# Altium project khoa so dien tu.PrjPcb
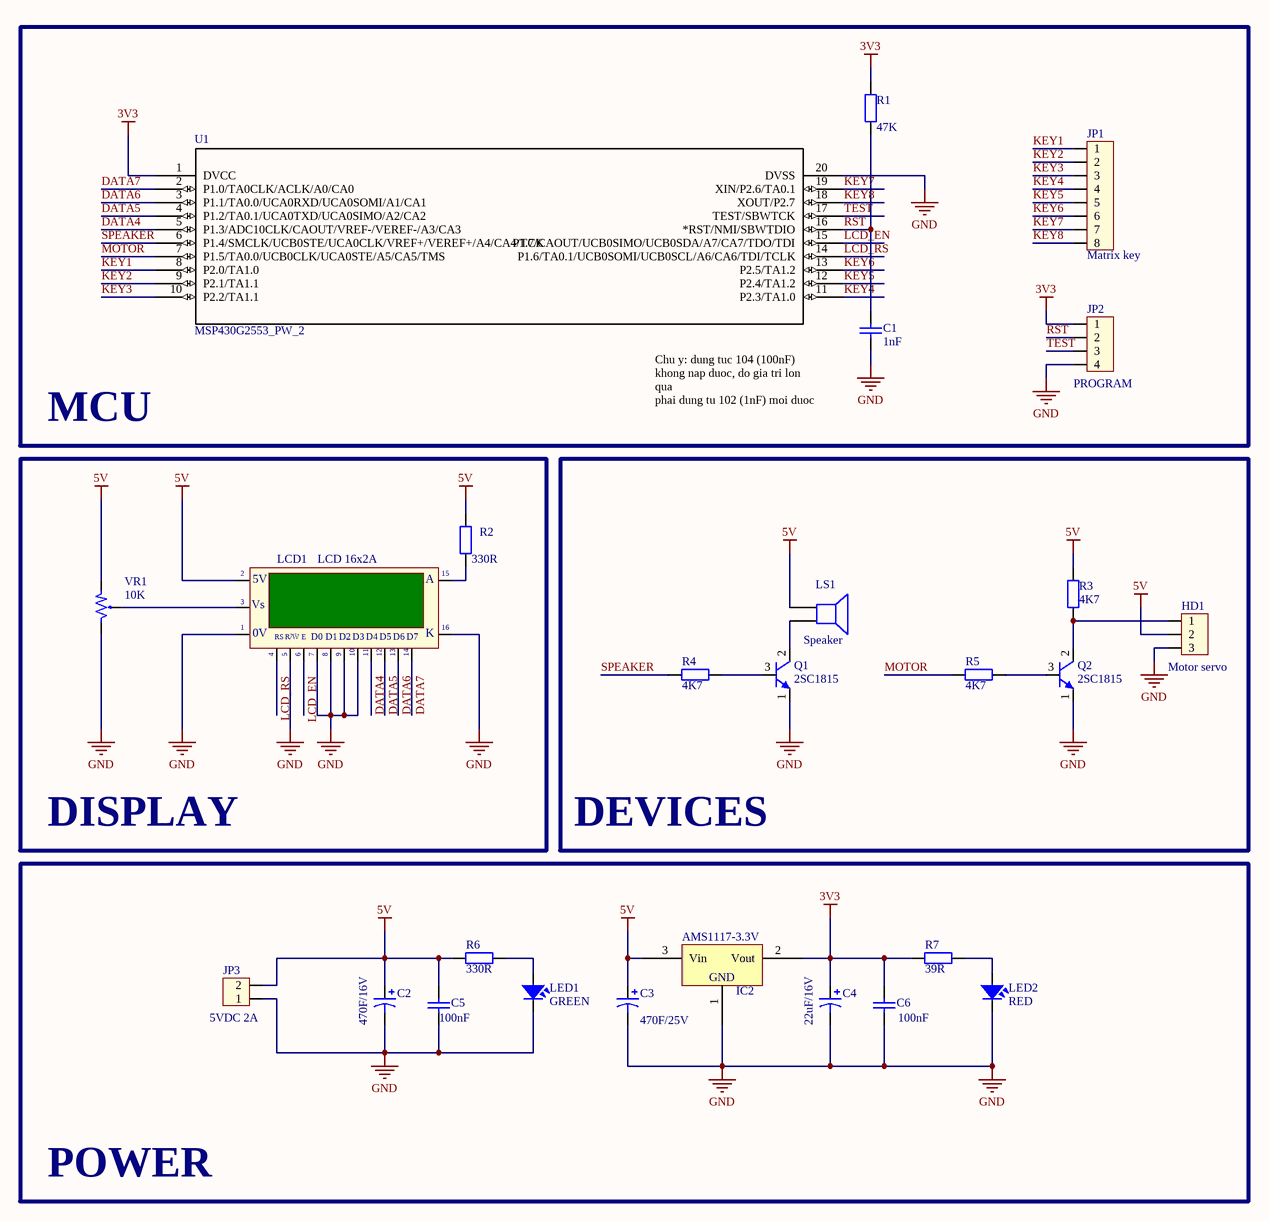
[diagram p0: khoa so dien tu.SchDoc]
1 sheet, 26 parts. Net scope: global (net labels, ports and power ports of the same name join across sheets).

## Sheet khoa so dien tu.SchDoc: KHOA SO DIEN TU
size A3; Organization: DH Bach Khoa Da Nang; SheetNumber: 01; SheetTotal: 01; ProjectName: Khoa so dien tu

### Parts
C1  value 1nF  [Tu gom 104]  (hidden comment: Cap)
C2  value 470F/16V  [CAP_470UF_16V]  (hidden comment: Cap Pol1)
C3  value 470F/25V  [CAP_470UF_25V]  (hidden comment: Cap Pol1)
C4  value 22uF/16V  [CAP_22UF_16V]  (hidden comment: Cap Pol1)
C5  value 100nF  [Tu gom 104]  (hidden comment: Cap)
C6  value 100nF  [Tu gom 104]  (hidden comment: Cap)
HD1  Motor servo  [Header_3]
IC2  AMS1117-3.3V  [AMS1117-3.3V]
JP1  Matrix key  [Header_8]
JP2  PROGRAM  [Header_4]
JP3  5VDC 2A  [CON2]
LCD1  LCD 16x2A  [LCD16x2]
LED1  GREEN  [LED3G]
LED2  RED  [LED3R]
LS1  Speaker  [SPEAKER]
Q1  2SC1815  [2SC1815]
Q2  2SC1815  [2SC1815]
R1  value 47K  [RES 1/4W CFR25]  (hidden comment: Res2)
R2  value 330R  [RES 1/4W CFR25]  (hidden comment: Res2)
R3  value 4K7  [RES 1/4W CFR25]  (hidden comment: Res2)
R4  value 4K7  [RES 1/4W CFR25]  (hidden comment: Res2)
R5  value 4K7  [RES 1/4W CFR25]  (hidden comment: Res2)
R6  value 330R  [RES 1/4W CFR25]  (hidden comment: Res2)
R7  value 39R  [RES 1/4W CFR25]  (hidden comment: Res2)
U1  MSP430G2553_PW_2  [MSP430G2553]
VR1  10K  [VR1]

### Blocks framed on the sheet
MCU: C1 JP1 JP2 R1 U1
DISPLAY: LCD1 R2 VR1
DEVICES: HD1 LS1 Q1 Q2 R3-R5
POWER: C2-C6 IC2 JP3 LED1 LED2 R6 R7

### Nets
3V3: C4.1 C6.2 IC2.2(Vout) JP2.1 R1.2 R7.2 U1.1(DVCC)
5V: C2.1 C3.1 C5.2 HD1.2 IC2.3(Vin) JP3.2 LCD1.2(VDD) LS1.2 R2.2 R3.2 R6.2 VR1.1
GND: C1.2 C2.2 C3.2 C4.2 C5.1 C6.1 HD1.3 IC2.1(GND) JP2.4 JP3.1 LCD1.1(GND) LCD1.5(R/~{W}) LCD1.7(D0) LCD1.8(D1) LCD1.9(D2) LCD1.10(D3) LCD1.16(K) LED1.2 LED2.2 Q1.1(E) Q2.1(E) U1.20(DVSS) VR1.3
DATA4: LCD1.11(D4) U1.5(P1.3/ADC10CLK/CAOUT/VREF-/VEREF-/A3/CA3)
DATA5: LCD1.12(D5) U1.4(P1.2/TA0.1/UCA0TXD/UCA0SIMO/A2/CA2)
DATA6: LCD1.13(D6) U1.3(P1.1/TA0.0/UCA0RXD/UCA0SOMI/A1/CA1)
DATA7: LCD1.14(D7) U1.2(P1.0/TA0CLK/ACLK/A0/CA0)
KEY1: JP1.1 U1.8(P2.0/TA1.0)
KEY2: JP1.2 U1.9(P2.1/TA1.1)
KEY3: JP1.3 U1.10(P2.2/TA1.1)
KEY4: JP1.4 U1.11(P2.3/TA1.0)
KEY5: JP1.5 U1.12(P2.4/TA1.2)
KEY6: JP1.6 U1.13(P2.5/TA1.2)
KEY7: JP1.7 U1.19(XIN/P2.6/TA0.1)
KEY8: JP1.8 U1.18(XOUT/P2.7)
LCD_EN: LCD1.6(~{EN}) U1.15(P1.7/CAOUT/UCB0SIMO/UCB0SDA/A7/CA7/TDO/TDI)
LCD_RS: LCD1.4(RS) U1.14(P1.6/TA0.1/UCB0SOMI/UCB0SCL/A6/CA6/TDI/TCLK)
MOTOR: R5.1 U1.7(P1.5/TA0.0/UCB0CLK/UCA0STE/A5/CA5/TMS)
RST: C1.1 JP2.2 R1.1 U1.16(*RST/NMI/SBWTDIO)
SPEAKER: R4.1 U1.6(P1.4/SMCLK/UCB0STE/UCA0CLK/VREF+/VEREF+/A4/CA4/TCK)
TEST: JP2.3 U1.17(TEST/SBWTCK)
NetHD1_1: HD1.1 Q2.2(C) R3.1
NetLCD1_3: LCD1.3(VEE) VR1.2
NetLCD1_15: LCD1.15(A) R2.1
NetLED1_1: LED1.1 R6.1
NetLED2_1: LED2.1 R7.1
NetLS1_1: LS1.1 Q1.2(C)
NetQ1_3: Q1.3(B) R4.2
NetQ2_3: Q2.3(B) R5.2

### Notes on the sheet
- Chu y: dung tuc 104 (100nF) khong nap duoc, do gia tri lon qua
  phai dung tu 102 (1nF) moi duoc
- Title
- Size:
- Date:
- A3
- Number:
- Time:
- Revision:
- Sheet
- of
- LẠI PHƯỚC SƠN
- Lpson.tth@gmail.com
- Lớp học ALTIUM
- File:
- (in symbol LCD16x2A) 5V; Vs; |; 0V; R/W; E

### Library data of the parts
C1 C5 C6 = Cap: Capacitor; Published: 8-Jun-2000; LatestRevisionDate: 17-Jul-2002; LatestRevisionNote: Re-released for DXP Platform.; PackageReference: RAD-0.3; Publisher: Altium Limited; PackageDescription: Radial Cap, Thru-Hole; 2 Leads; 0.3 in Pin Spacing
C2-C4 = Cap Pol1: Polarized Capacitor (Radial); Published: 8-Jun-2000; LatestRevisionDate: 17-Jul-2002; LatestRevisionNote: Re-released for DXP Platform.; PackageReference: RB7.6-15; Publisher: Altium Limited; PackageDescription: Polarized Capacitor (Radial); 2 Leads
HD1 = Hed3: Header 3 (Green); Value: Header 3
IC2 = AMS1117
JP1 = Con8: Connector 8; Value: Connector 8
JP2 = Con4: Connector 4; Value: Connector 4
JP3 = Con2: Connector 2; Value: Connector 2
LCD1 = LCD16x2A: LCD dipslay 16 char, 2 line; Value: LCD16x2A
LED1 LED2 = LED: LED Single colour Green and Red; Value: LED 3 ly Single Colour
LS1 = Speaker: Loudspeaker; Published: 24-Mar-1999; LatestRevisionDate: 17-Jul-2002; LatestRevisionNote: Re-released for DXP Platform.; PackageReference: PIN2; Publisher: Altium Limited
Q1 Q2 = 2SC1815: Trans NPN 50V 150mA TO-92; ComponentLink1Description: Datasheet; ComponentLink1URL: D:\Dropbox\Datasheets\Transistors\P Channel Bipolar\2SC1815.pdf; Unit Price: 0.0143
R1-R7 = Res2: Resistor; Published: 8-Jun-2000; LatestRevisionDate: 17-Jul-2002; LatestRevisionNote: Re-released for DXP Platform.; PackageReference: AXIAL-0.4; Publisher: Altium Limited; PackageDescription: Axial Device, Thru-Hole; 2 Leads; 0.4 in Pin Spacing
U1 = MSP430G2553_PW_2: Imported; Manufacturer_Part_Number: msp430g2553_pw_20; Vendor: Texas Instruments; PACKAGE_DESIGNATOR: PW; PIN_COUNT: 20; FAMILY_NAME: Value Line; INDUSTRY_STD_PKG_TYPE: TSSOP; GENERIC_PART_NUMBER: MSP430G2553; Datasheet URL: http://www.ti.com/lit/gpn/MSP430G2553; Manufacturer: Texas Instruments; RefDes: RefDes; Type: DEV; Value: Value
VR1 = VR1: Var Resistor; Value: VR 10K